# Altium schematic sheet 示波器原理图6.SchDoc
size A4
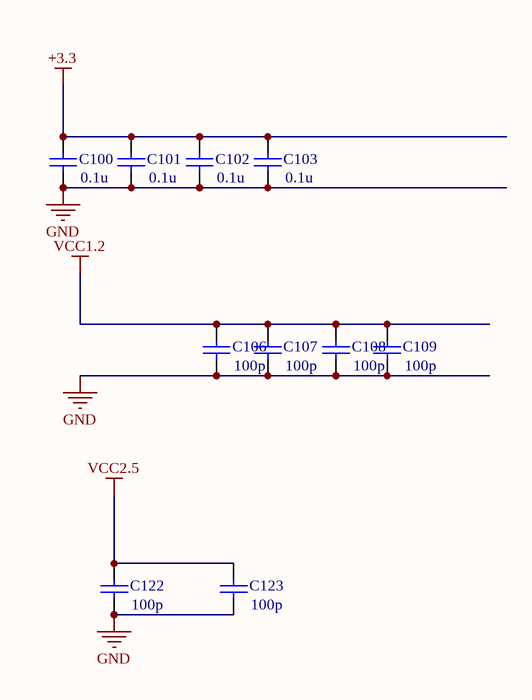
[diagram p0: 示波器原理图6.SchDoc]

## Parts
C100  value 0.1u  [PCBComponent_1]
C101  value 0.1u  [PCBComponent_1]
C102  value 0.1u  [PCBComponent_1]
C103  value 0.1u  [PCBComponent_1]
C106  value 100p  [PCBComponent_1]
C107  value 100p  [PCBComponent_1]
C108  value 100p  [PCBComponent_1]
C109  value 100p  [PCBComponent_1]
C122  value 100p  [PCBComponent_1]
C123  value 100p  [PCBComponent_1]

## Nets
+3.3: C100.2 C101.2 C102.2 C103.2
GND: C100.1 C101.1 C102.1 C103.1 C106.1 C107.1 C108.1 C109.1 C122.1 C123.1
VCC1.2: C106.2 C107.2 C108.2 C109.2
VCC2.5: C122.2 C123.2

## Library data of the parts
C100-C103 C106-C109 C122 C123 = Cap Semi: Capacitor (Semiconductor SIM Model); Published: 8-Jun-2000; LatestRevisionDate: 17-Jul-2002; LatestRevisionNote: Re-released for DXP Platform.; PackageReference: C1206; Publisher: Altium Limited